# Altium project CANFD_SIC_transciever.PrjPcb
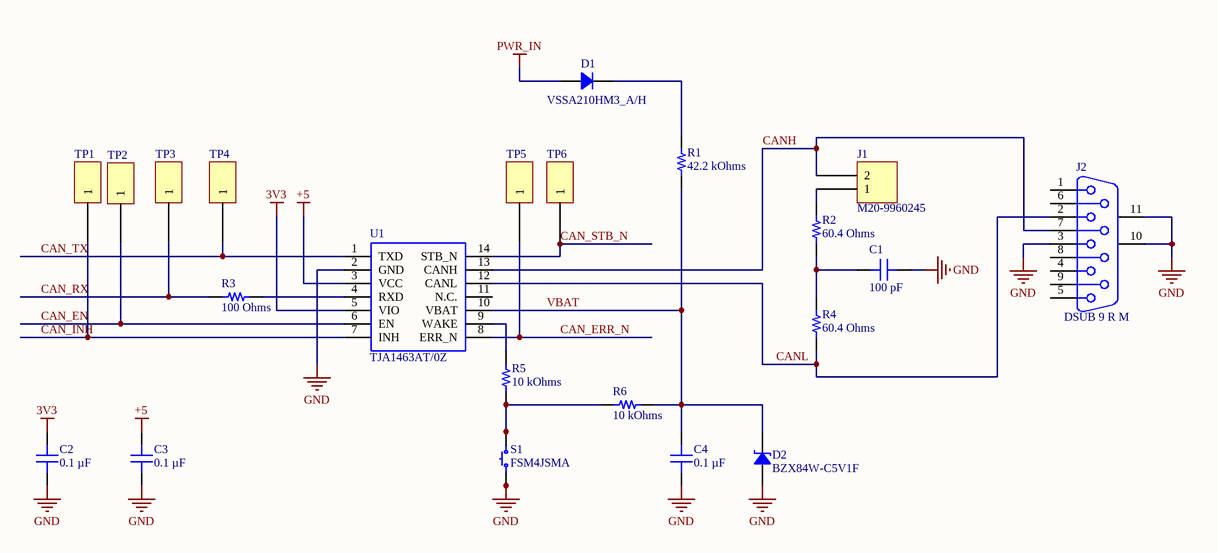
[diagram p0: CANFD_SIC_transciever_with_WAKE_and_SLEEP.SchDoc]
1 sheet, 22 parts. Net scope: global (net labels, ports and power ports of the same name join across sheets).
Board file: CANFD_SIC_transciever_with_WAKE_and_SLEEP.PcbDoc

## Sheet CANFD_SIC_transciever_with_WAKE_and_SLEEP.SchDoc
size A; SheetNumber: 1; SheetTotal: 1

### Parts
C1  100 pF  [CAP 0603_1608]
C2  0.1 µF  [CAP 0603_1608]
C3  0.1 µF  [CAP 0603_1608]
C4  0.1 µF  [CAP 0603_1608]
D1  VSSA210HM3_A/H  [DO214AC SMA]
D2  BZX84W-C5V1F  [DIODES SOT-323-3]
J1  M20-9960245  [HARWIN M20-9960245]
J2  DSUB 9 R M  [DSUB9_R_M]
R1  42.2 kOhms  [RES 0805_2012]
R2  60.4 Ohms  [RES 0603_1608]
R3  100 Ohms  [RES 0805_2012]
R4  60.4 Ohms  [RES 0603_1608]
R5  10 kOhms  [RES 0805_2012]
R6  10 kOhms  [RES 0805_2012]
S1  FSM4JSMA  [TE FSM4JSMA]
TP1  SSW-101-03-T-S  [SAMTEC SSW-101-03-T-S]  (value not drawn)
TP2  SSW-101-03-T-S  [SAMTEC SSW-101-03-T-S]  (value not drawn)
TP3  SSW-101-03-T-S  [SAMTEC SSW-101-03-T-S]  (value not drawn)
TP4  SSW-101-03-T-S  [SAMTEC SSW-101-03-T-S]  (value not drawn)
TP5  SSW-101-03-T-S  [SAMTEC SSW-101-03-T-S]  (value not drawn)
TP6  SSW-101-03-T-S  [SAMTEC SSW-101-03-T-S]  (value not drawn)
U1  TJA1463AT/0Z  [SOIC127P600X175-14N]

### Nets
3V3: C2.2 U1.5(VIO)
+5: C3.2 U1.3(VCC)
GND: C1.2 C2.1 C3.1 C4.1 D2.1 J2.3 J2.10(MH1) J2.11(MH2) S1.1 S1.2 U1.2(GND)
PWR_IN: D1.1
CAN_EN: TP2.1 U1.6(EN)
CAN_ERR_N: TP5.1 U1.8(ERR_N)
CAN_INH: TP1.1 U1.7(INH)
CAN_STB_N: TP6.1 U1.14(STB_N)
CAN_TX: TP4.1 U1.1(TXD)
CANH: J1.2 J2.7 U1.13(CANH)
CANL: J2.2 R4.1 U1.12(CANL)
VBAT: C4.2 D2.2 R1.1 R6.2 U1.10(VBAT)
NetC1_1: C1.1 R2.1 R4.2
NetD1_2: D1.2 R1.2
NetJ1_1: J1.1 R2.2
NetR3_1: R3.1 TP3.1
NetR3_2: R3.2 U1.4(RXD)
NetR5_1: R5.1 R6.1 S1.3 S1.4
NetR5_2: R5.2 U1.9(WAKE)

Not connected (* = marked no-connect by the designer): J2 1 4 5 6 8 9; U1 11(N.C.)

### Notes on the sheet
- Labels drawn without touching a wire or pin: CAN_RX

### Library data of the parts
C1 = CC0603JRNPO0BN101: CAP CER 100PF 100V C0G/NPO 0603; manufacturer: Yageo; Temperature Coefficient: C0G, NP0; Tolerance: ±5%; Part Number: CC0603JRNPO0BN101; Value: 100 pF; Applications: General Purpose; Capacitance: 100 pF; componentlink1description: Datasheet; componentlink1url: http://www.yageo.com/documents/recent/UPY-NP0X7R_MV_100-to-630V_21.pdf; componentlink2description: DigiKey Link; componentlink2url: https://www.digikey.com/en/products/detail/yageo/CC0603JRNPO0BN101/5195154; Device Package: 0603 (1608 Metric); lastupdated: 9/19/2022 1:01:16 PM; Lifecycle Status: Active; Minimum Order: 1; Mounting Type: Surface Mount, MLCC; Operating Temperature: -55°C ~ 125°C; Package / Case: 0603 (1608 Metric); packaging: TapeAndReel; partid: 3543; Part Status: Active; price: 0.01; series: CC; Size / Dimension: 0.063" L x 0.031" W (1.60mm x 0.80mm); Supplier 1: DigiKey; Supplier Part Number 1: 311-1745-1-ND; Thickness (Max): 0.035" (0.90mm); Voltage - Rated: 100V
C2-C4 = CS0603KRX7R7BB104: CAP CER 0.1UF 16V X7R 0603; manufacturer: Yageo; Tolerance: ±10%; Part Number: CS0603KRX7R7BB104; Value: 0.1 µF; Applications: Boardflex Sensitive; Capacitance: 0.1 µF; componentlink1description: Datasheet; componentlink1url: http://www.yageo.com/NewPortal/yageodocoutput?fileName=/pdf/MLCC/UPY-ST_NPOX7R_16V-to-3KV_5.pdf; componentlink2description: DigiKey Link; componentlink2url: https://www.digikey.com/en/products/detail/yageo/CS0603KRX7R7BB104/6097897; Device Package: 0603 (1608 Metric); Features: Soft Termination; lastupdated: 9/19/2022 1:01:20 PM; Lifecycle Status: Active; Minimum Order: 1; Mounting Type: Surface Mount, MLCC; Operating Temperature: -55°C ~ 125°C; Package / Case: 0603 (1608 Metric); packaging: TapeAndReel; partid: 2286; Part Status: Active; price: 0.02; series: CS; Size / Dimension: 0.063" L x 0.031" W (1.60mm x 0.80mm); Supplier 1: DigiKey; Supplier Part Number 1: 311-3560-1-ND; Temperature Coefficient: X7R; Thickness (Max): 0.037" (0.95mm); Voltage - Rated: 16V
D1 = VSSA210HM3_A/H: DIODE SCHOTTKY 100V 2A DO214AC; Manufacturer: Vishay Semiconductor Diodes Division; Capacitance @ Vr, F: 175pF @ 4V, 1MHz; Current - Average Rectified (Io): 2A (DC); Current - Reverse Leakage @ Vr: 150µA @ 100V; Speed: Fast Recovery =< 500ns, > 200mA (Io); Voltage - Forward (Vf) (Max) @ If: 700mV @ 2A; Part Number: VSSA210HM3_A/H; ComponentLink1Description: Datasheet; ComponentLink1URL: http://www.vishay.com/docs/89404/vssa210-m3.pdf; ComponentLink2Description: DigiKey Link; ComponentLink2URL: http://digikey.com/product-detail/en/vishay-semiconductor-diodes-division/VSSA210HM3_A-H/VSSA210HM3_A-HGICT-ND/7717343; Diode Type: Schottky; LastUpdated: 9/19/2022 1:46:13 PM; Lifecycle Status: Active; Minimum Order: 1; Mounting Type: Surface Mount; Operating Temperature - Junction: -40°C ~ 150°C; Package / Case: DO-214AC, SMA; Packaging: TapeAndReel; PartId: 1977; Part Status: Active; Price: 0.12; Series: Automotive, AEC-Q101, TMBS®; Supplier 1: DigiKey; Supplier Part Number 1: VSSA210HM3_A/HGICT-ND; Supplier Device Package: DO-214AC (SMA); Voltage - DC Reverse (Vr) (Max): 100V
D2 = BZX84W-C5V1F: DIODE ZENER 5.1V 275MW SOT323; Manufacturer: Nexperia USA Inc.; Current - Reverse Leakage @ Vr: 2 µA @ 2 V; Impedance (Max) (Zzt): 60 Ohms; Tolerance: ±5%; Voltage - Forward (Vf) (Max) @ If: 900 mV @ 10 mA; Part Number: BZX84W-C5V1F; ComponentLink1Description: Datasheet; ComponentLink1URL: https://assets.nexperia.com/documents/data-sheet/BZX84W_SER.pdf; ComponentLink2Description: DigiKey Link; ComponentLink2URL: https://www.digikey.com/en/products/detail/nexperia-usa-inc/BZX84W-C5V1F/9380728; LastUpdated: 9/19/2022 1:51:23 PM; Lifecycle Status: Active; Minimum Order: 1; Mounting Type: Surface Mount; Operating Temperature: 150°C (TJ); Package / Case: SC-70, SOT-323; Packaging: TapeAndReel; PartId: 909; Part Status: Active; Power - Max: 275 mW; Price: 0.02; Series: Automotive, AEC-Q101; Supplier 1: DigiKey; Supplier Part Number 1: 1727-8313-1-ND; Supplier Device Package: SOT-323; Voltage - Zener (Nom) (Vz): 5.1 V
J1 = M20-9960245: CONN HEADER R/A 2POS 2.54MM; Manufacturer: Harwin Inc.; Connector Type: Header, Cuttable; Contact Length - Mating: 0.240" (6.10mm); Contact Length - Post: 0.118" (3.00mm); Current Rating (Amps): 3A per Contact; Material Flammability Rating: UL94 V-0; Number of Positions: 2; Number of Positions Loaded: All; Pitch - Mating: 0.100" (2.54mm); Row Spacing - Mating: -40°C ~ 105°C; Shrouding: Unshrouded; Style: Board to Board or Cable; Part Number: M20-9960245; ComponentLink1Description: Datasheet; ComponentLink1URL: https://cdn.harwin.com/pdfs/Harwin_PC_Connectors_M20.pdf; ComponentLink2Description: DigiKey Link; ComponentLink2URL: https://www.digikey.com/en/products/detail/harwin-inc/M20-9960245/3728208; Contact Finish - Mating: Gold; Contact Material: Brass; Contact Shape: Square; Contact Type: Male Pin; Fastening Type: Push-Pull; Insulation Color: Black; Insulation Height: 0.100" (2.54mm); Insulation Material: Polyamide (PA6T), Nylon 6T; LastUpdated: 9/21/2022 7:22:55 PM; Lifecycle Status: Active; Minimum Order: 1; Mounting Type: Through Hole, Right Angle; Number of Rows: 1; Operating Temperature: -40°C ~ 105°C; Packaging: Bulk; PartId: 165; Part Status: Active; Price: 0.07; Series: M20; Supplier 1: DigiKey; Supplier Part Number 1: 952-2244-ND; Termination: Solder
J2 = D09P33E6RX12LF: D-Sub Standard Connectors 9P PIN RA US STAND UNC 4-40 INSERT; Manufacturer 1: Amphenol FCI; Life Cycle State: Active; Current rating: 5A; Voltage rating: 300V; Part Number: D09P33E6RX12LF; Manufacturer Part Number 1: D09P33E6RX12LF; Package: DSUB9_R_M; Pin count: 9; Value: DSUB 9 R M; Temperature range: -55..125V; Supplier 1: Mouser; Supplier Part Number 1: 649-D09P33E6RX12LF; ComponentLink1Description: ProductPage; ComponentLink1URL: https://www.amphenol-cs.com/d-subminiature-delta-d-d09p33e6rx12lf.html
R1 = CRCW080542K2FKECC: RES 42.2K OHM 1% 1/8W 0805; Manufacturer: Vishay Dale; Power (Watts): 0.125W, 1/8W; Temperature Coefficient: ±100ppm/°C; Part Number: CRCW080542K2FKECC; Value: 42.2 kOhms; ComponentLink1Description: Datasheet; ComponentLink1URL: http://www.vishay.com/docs/28773/crcwce3.pdf; ComponentLink2Description: DigiKey Link; ComponentLink2URL: https://www.digikey.com/en/products/detail/vishay-dale/CRCW080542K2FKECC/7928552; Composition: Thick Film; Device Package: 0805 (2012 Metric); Height - Seated (Max): 0.024" (0.60mm); LastUpdated: 9/19/2022 1:36:51 PM; Lifecycle Status: Active; Minimum Order: 1; Number of Terminations: 2; Operating Temperature: -55°C ~ 155°C; Package / Case: 0805 (2012 Metric); Packaging: TapeAndReel; PartId: 30007; Part Status: Active; Price: 0.01; Resistance: 42.2 kOhms; Series: CRCW-C; Size / Dimension: 0.079" L x 0.049" W (2.00mm x 1.25mm); Supplier 1: DigiKey; Supplier Part Number 1: 541-4130-1-ND; Supplier Device Package: 0805; Tolerance: ±1%
R2 R4 = RK73H1JTTD60R4F: RES 60.4 OHM 1% 1/8W 0603; Manufacturer: KOA Speer Electronics, Inc.; Power (Watts): 0.125W, 1/8W; Temperature Coefficient: ±100ppm/°C; Part Number: RK73H1JTTD60R4F; Value: 60.4 Ohms; ComponentLink1Description: Datasheet; ComponentLink1URL: http://www.koaspeer.com/catimages/Products/RK73H/RK73H.pdf; ComponentLink2Description: DigiKey Link; ComponentLink2URL: https://www.digikey.com/en/products/detail/koa-speer-electronics-inc/RK73H1JTTD60R4F/9845016; Composition: Thick Film; Device Package: 0603 (1608 Metric); Features: Automotive AEC-Q200, Moisture Resistant; Height - Seated (Max): 0.022" (0.55mm); LastUpdated: 9/19/2022 1:22:33 PM; Lifecycle Status: Active; Minimum Order: 1; Number of Terminations: 2; Operating Temperature: -55°C ~ 155°C; Package / Case: 0603 (1608 Metric); Packaging: CutTape; PartId: 5191; Part Status: Active; Price: 0.01; Ratings: AEC-Q200; Resistance: 60.4 Ohms; Series: RK73H; Size / Dimension: 0.063" L x 0.031" W (1.60mm x 0.80mm); Supplier 1: DigiKey; Supplier Part Number 1: 2019-RK73H1JTTD60R4FCT-ND; Supplier Device Package: 0603; Tolerance: ±1%
R3 = ERJ-6ENF1000V: RES SMD 100 OHM 1% 1/8W 0805; Manufacturer: Panasonic Electronic Components; Power (Watts): 0.125W, 1/8W; Temperature Coefficient: ±100ppm/°C; Part Number: ERJ-6ENF1000V; Value: 100 Ohms; ComponentLink1Description: Datasheet; ComponentLink1URL: https://industrial.panasonic.com/cdbs/www-data/pdf/RDA0000/AOA0000C304.pdf; ComponentLink2Description: DigiKey Link; ComponentLink2URL: https://www.digikey.com/en/products/detail/panasonic-electronic-components/ERJ-6ENF1000V/111089; Composition: Thick Film; Device Package: 0805 (2012 Metric); Features: Automotive AEC-Q200; Height - Seated (Max): 0.028" (0.70mm); LastUpdated: 9/19/2022 1:36:43 PM; Lifecycle Status: Active; Minimum Order: 1; Number of Terminations: 2; Operating Temperature: -55°C ~ 155°C; Package / Case: 0805 (2012 Metric); Packaging: TapeAndReel; PartId: 32261; Part Status: Active; Price: 0.01; Ratings: AEC-Q200; Resistance: 100 Ohms; Series: ERJ-6EN; Size / Dimension: 0.079" L x 0.049" W (2.00mm x 1.25mm); Supplier 1: DigiKey; Supplier Part Number 1: P100CCT-ND; Supplier Device Package: 0805; Tolerance: ±1%
R5 R6 = RT0805FRE0710KL: RES SMD 10K OHM 1% 1/8W 0805; Manufacturer: Yageo; Power (Watts): 0.125W, 1/8W; Temperature Coefficient: ±50ppm/°C; Part Number: RT0805FRE0710KL; Value: 10 kOhms; ComponentLink1Description: Datasheet; ComponentLink1URL: https://www.yageo.com/upload/media/product/productsearch/datasheet/rchip/PYu-RT_1-to-0.01_RoHS_L_11.pdf; ComponentLink2Description: DigiKey Link; ComponentLink2URL: https://www.digikey.com/en/products/detail/yageo/RT0805FRE0710KL/1078908; Composition: Thin Film; Device Package: 0805 (2012 Metric); Height - Seated (Max): 0.024" (0.60mm); LastUpdated: 9/19/2022 1:36:42 PM; Lifecycle Status: Active; Minimum Order: 1; Number of Terminations: 2; Operating Temperature: -55°C ~ 155°C; Package / Case: 0805 (2012 Metric); Packaging: TapeAndReel; PartId: 32332; Part Status: Active; Price: 0.01; Resistance: 10 kOhms; Series: RT; Size / Dimension: 0.079" L x 0.049" W (2.00mm x 1.25mm); Supplier 1: DigiKey; Supplier Part Number 1: YAG1239CT-ND; Supplier Device Package: 0805; Tolerance: ±1%
S1 = FSM4JSMA: SWITCH TACTILE SPST-NO 0.05A 24V; Manufacturer: TE Connectivity ALCOSWITCH Switches; Actuator Height off PCB, Vertical: 5.00mm; Actuator Orientation: Top Actuated; Actuator Type: Standard; Contact Rating @ Voltage: 0.05A @ 24VDC; Illumination: Non-Illuminated; Operating Force: 160gf; Outline: 6.00mm x 6.00mm; Switch Function: Off-Mom; Part Number: FSM4JSMA; Circuit: SPST-NO; ComponentLink1Description: Datasheet; ComponentLink1URL: https://www.te.com/commerce/DocumentDelivery/DDEController?Action=srchrtrv&DocNm=1308111-1_SWITCHES_CORE_PROGRAM_CATALOG&DocType=CS&DocLang=English; ComponentLink2Description: DigiKey Link; ComponentLink2URL: https://www.digikey.com/en/products/detail/te-connectivity-alcoswitch-switches/FSM4JSMA/525821; LastUpdated: 9/19/2022 2:02:57 PM; Lifecycle Status: Active; Minimum Order: 1; Mounting Type: Surface Mount; Operating Temperature: -35°C ~ 85°C; Packaging: Bulk; Part Status: Active; Price: 0.14; Series: FSMJSMA; Supplier 1: DigiKey; Supplier Part Number 1: 450-1129-ND; Termination Style: Gull Wing
TP1-TP6 = SSW-101-03-T-S: CONN RCPT 1POS TIN PCB; Manufacturer: Samtec Inc.; Connector Type: Receptacle; Current Rating (Amps): 5.7A per Contact; Material Flammability Rating: UL94 V-0; Number of Positions: 1; Number of Positions Loaded: All; Style: Board to Board or Cable; Part Number: SSW-101-03-T-S; ComponentLink2Description: DigiKey Link; ComponentLink2URL: http://digikey.com/product-detail/en/samtec-inc/SSW-101-03-T-S/SSW-101-03-T-S-ND/7872591; Contact Finish - Mating: Tin; Contact Finish - Post: Tin; Contact Type: Forked; Fastening Type: Push-Pull; Insulation Color: Black; LastUpdated: 6/21/2022 3:04:54 PM; Lifecycle Status: Active; Minimum Order: 1; Mounting Type: Through Hole; Number of Rows: 1; Operating Temperature: -55°C ~ 105°C; Packaging: Bulk; Part Status: Active; Price: 0.59; Series: SSW; Supplier 1: DigiKey; Supplier Part Number 1: SSW-101-03-T-S-ND; Termination: Solder
U1 = TJA1463AT/0Z: CAN SIC transciever; Manufacturer_Name: NXP; Geometry.Height: 1.75mm; Life Cycle State: Active; Mouser Part Number: 771-TJA1463AT/0Z; Mouser Price/Stock: https://www.mouser.co.uk/ProductDetail/NXP-Semiconductors/TJA1463AT-0Z?qs=eP2BKZSCXI71yVMPsVk58A%3D%3D; Manufacturer_Part_Number: TJA1463AT/0Z; Datasheet Link: https://www.arrow.com/en/products/tja1463at0z/nxp-semiconductors?region=nac; Part Number: TJA1463AT/0Z; Value: TJA1463AT/0Z; Manufacturer Part Number 1: TJA1463AT/0Z; Package: SOIC 14; Temperature range: -40..150C; Supplier 1: Mouser; Supplier Part Number 1: 771-TJA1463AT/0Z; ComponentLink1Description: Datasheet; ComponentLink1URL: https://www.nxp.com/docs/en/data-sheet/TJA1463.pdf; Manufacturer 1: NXP